# EAGLE design control (EAGLE 9.0.0)
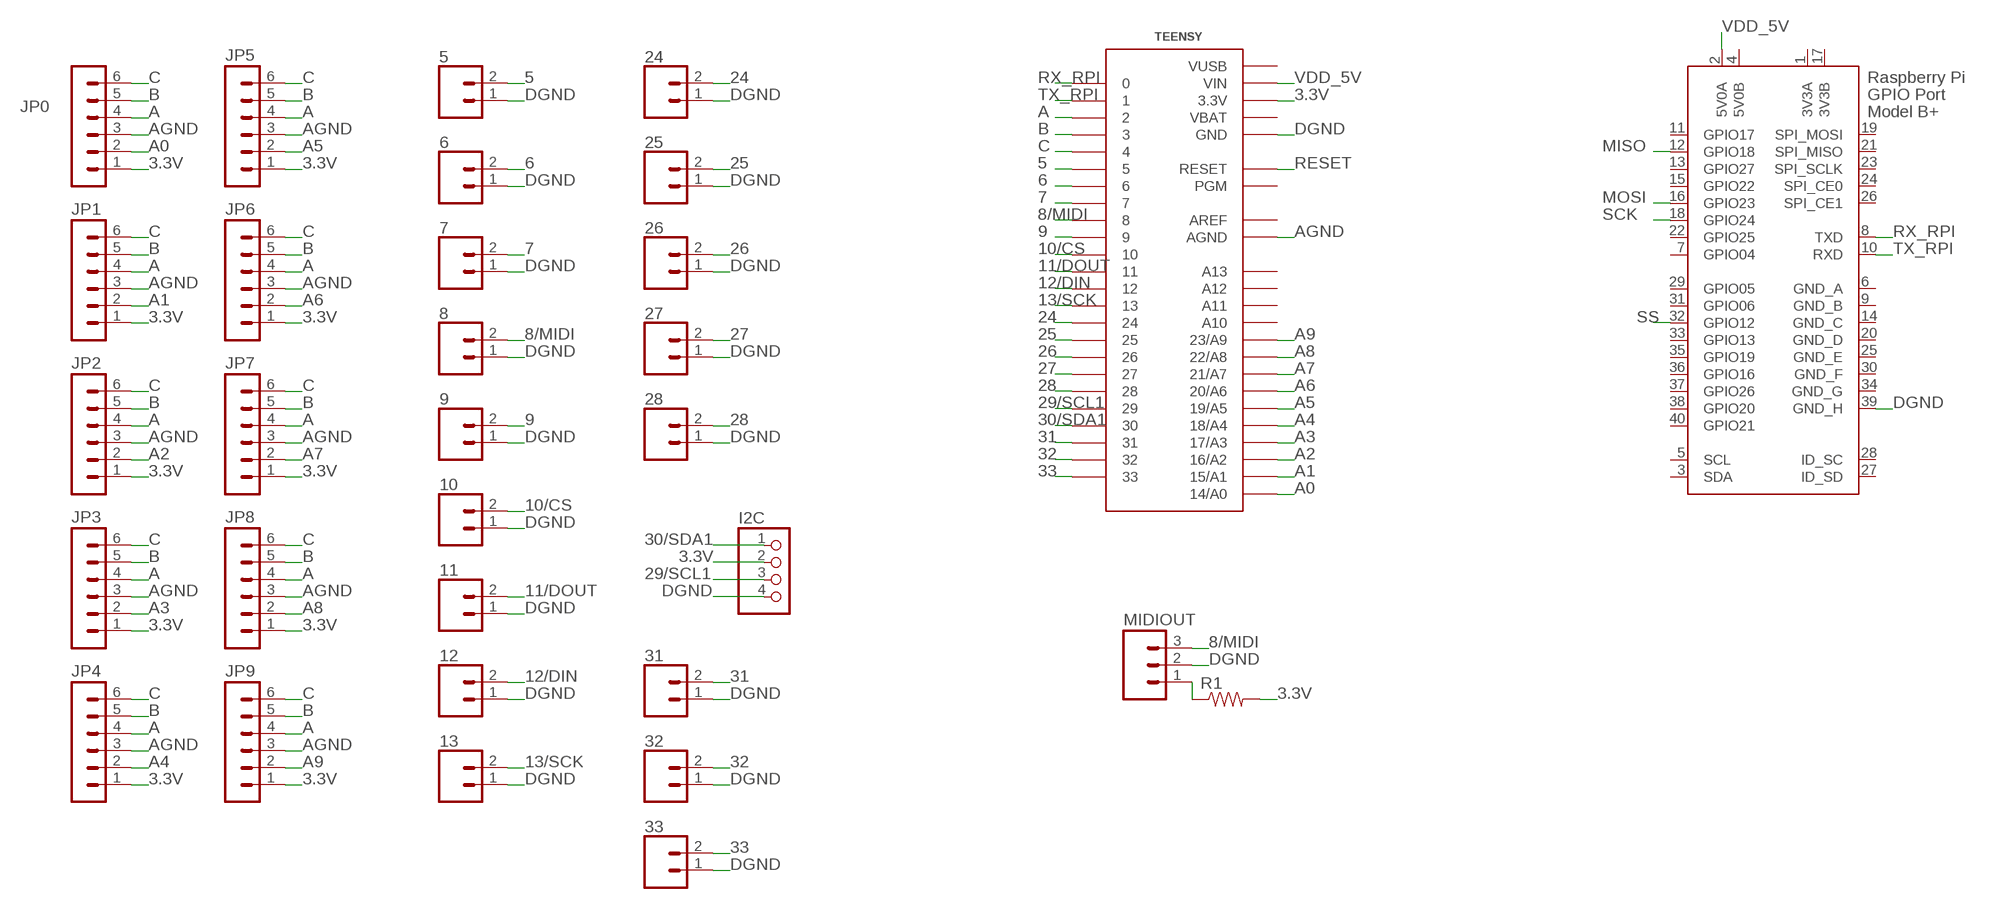
[diagram p0: schematic, sheet 1]

## Parts
5  CONN_02  [1X02]
6  CONN_02  [1X02]
7  CONN_02  [1X02]
8  CONN_02  [1X02]
9  CONN_02  [1X02]
10  CONN_02  [1X02]
11  CONN_02  [1X02]
12  CONN_02  [1X02]
13  CONN_02  [1X02]
24  CONN_02  [1X02]
25  CONN_02  [1X02]
26  CONN_02  [1X02]
27  CONN_02  [1X02]
28  CONN_02  [1X02]
31  CONN_02  [1X02]
32  CONN_02  [1X02]
33  CONN_02  [1X02]
I2C  PINHD-1X4  [1X04]
JP0  MA06-1  [MA06-1]
JP1  MA06-1  [MA06-1]
JP2  MA06-1  [MA06-1]
JP3  MA06-1  [MA06-1]
JP4  MA06-1  [MA06-1]
JP5  MA06-1  [MA06-1]
JP6  MA06-1  [MA06-1]
JP7  MA06-1  [MA06-1]
JP8  MA06-1  [MA06-1]
JP9  MA06-1  [MA06-1]
MIDIOUT  M03PTH  [1X03]
R1  RESISTORAXIAL-0.3  [AXIAL-0.3]
TEENSY  TEENSY_3.0_ALLPINS  [TEENSY_3.0_ALLPINS]
X1  RASPI_BOARD_B+#_H  [RASPI_BOARD_B+HAT]

## Nets
3.3V: I2C.2 JP0.1 JP1.1 JP2.1 JP3.1 JP4.1 JP5.1 JP6.1 JP7.1 JP8.1 JP9.1 R1.P$2 TEENSY.3.3V TEENSY.3.3V1(3.3V) TEENSY.3.3V2(3.3V)
5: 5.2 TEENSY.5
6: 6.2 TEENSY.6
7: 7.2 TEENSY.7
8/MIDI: 8.2 MIDIOUT.3 TEENSY.8
9: 9.2 TEENSY.9
10/CS: 10.2 TEENSY.10
11/DOUT: 11.2 TEENSY.11
12/DIN: 12.2 TEENSY.12
13/SCK: 13.2 TEENSY.13
24: 24.2 TEENSY.24
25: 25.2 TEENSY.25
26: 26.2 TEENSY.26
27: 27.2 TEENSY.27
28: 28.2 TEENSY.28
29/SCL1: I2C.3 TEENSY.29
30/SDA1: I2C.1 TEENSY.30
31: 31.2 TEENSY.31
32: 32.2 TEENSY.32
33: 33.2 TEENSY.33
A: JP0.4 JP1.4 JP2.4 JP3.4 JP4.4 JP5.4 JP6.4 JP7.4 JP8.4 JP9.4 TEENSY.2
A0: JP0.2 TEENSY.14/A0
A1: JP1.2 TEENSY.15/A1
A2: JP2.2 TEENSY.16/A2
A3: JP3.2 TEENSY.17/A3
A4: JP4.2 TEENSY.18/A4
A5: JP5.2 TEENSY.19/A5
A6: JP6.2 TEENSY.20/A6
A7: JP7.2 TEENSY.21/A7
A8: JP8.2 TEENSY.22/A8
A9: JP9.2 TEENSY.23/A9
AGND: JP0.3 JP1.3 JP2.3 JP3.3 JP4.3 JP5.3 JP6.3 JP7.3 JP8.3 JP9.3 TEENSY.AGND
B: JP0.5 JP1.5 JP2.5 JP3.5 JP4.5 JP5.5 JP6.5 JP7.5 JP8.5 JP9.5 TEENSY.3
C: JP0.6 JP1.6 JP2.6 JP3.6 JP4.6 JP5.6 JP6.6 JP7.6 JP8.6 JP9.6 TEENSY.4
DGND: 5.1 6.1 7.1 8.1 9.1 10.1 11.1 12.1 13.1 24.1 25.1 26.1 27.1 28.1 31.1 32.1 33.1 I2C.4 MIDIOUT.2 TEENSY.GND TEENSY.GND1(GND) TEENSY.GND2(GND) X1.39(GND_H)
MISO: X1.12(GPIO18)
MOSI: X1.16(GPIO23)
N$3: MIDIOUT.1 R1.P$1
RESET: TEENSY.RESET
RX_RPI: TEENSY.0 X1.8(TXD)
SCK: X1.18(GPIO24)
SS: X1.32(GPIO12)
TX_RPI: TEENSY.1 X1.10(RXD)
VDD_5V: TEENSY.VIN X1.2(5V0A)
Unconnected: TEENSY.A10 TEENSY.A11 TEENSY.A12 TEENSY.A13 TEENSY.PGM X1.3(SDA) X1.5(SCL) X1.7(GPIO04) X1.11(GPIO17) X1.13(GPIO27) X1.15(GPIO22) X1.19(SPI_MOSI) X1.21(SPI_MISO) X1.22(GPIO25) X1.23(SPI_SCLK) X1.24(SPI_CE0) X1.26(SPI_CE1) X1.27(ID_SD) X1.28(ID_SC) X1.29(GPIO05) X1.31(GPIO06) X1.33(GPIO13) X1.35(GPIO19) X1.36(GPIO16) X1.37(GPIO26) X1.38(GPIO20) X1.40(GPIO21)

## Power pins joined to a net without a drawn wire
3V3A: X1.1(3V3A)
3V3B: X1.17(3V3B)
5V0B: X1.4(5V0B)
AREF: TEENSY.AREF
GND_A: X1.6(GND_A)
GND_B: X1.9(GND_B)
GND_C: X1.14(GND_C)
GND_D: X1.20(GND_D)
GND_E: X1.25(GND_E)
GND_F: X1.30(GND_F)
GND_G: X1.34(GND_G)
VBAT: TEENSY.VBAT
VUSB: TEENSY.VUSB

## Library data of the parts
5-13 24-28 31-33 = SparkFun-Connectors:CONN_02: Multi connection point. Often used as Generic Header-pin footprint for 0.1 inch spaced/style header connections On any of the 0.1 inch spaced packages, you can populate with these: Break Away Headers - Straight <https://www.sparkfun.com/products/116> (PRT-00116) Break Away Male Headers - Right Angle <https://www.sparkfun.com/products/553> (PRT-00553) Female Headers <https://www.sparkfun.com/products/115> (PRT-00115) Break Away Headers - Machine Pin <https://www.sparkfun.com/products/117> (PRT-00117) Break Away Female Headers - Swiss Machine Pin <https://www.sparkfun.com/products/743> (PRT-00743) For SCREWTERMINALS and SPRING TERMINALS visit here: Screw Terimnals on SparkFun.com <https://www.sparkfun.com/search/results?term=Screw+Terminals> (5mm/3.5mm/2.54mm spacing) This device is also useful as a general connection point to wire up your design to another part of your project. Our various solder wires solder well into these plated through hole pads. Hook-Up Wire - Assortment (Stranded, 22 AWG) <https://www.sparkfun.com/products/11375> (PRT-11375) Hook-Up Wire - Assortment (Solid Core, 22 AWG) <https://www.sparkfun.com/products/11367> (PRT-11367) View the entire wire category on our website here <https://www.sparkfun.com/categories/141> Special notes: Molex polarized connector foot print use with: PRT-08233 with associated crimp pins and housings. 2.54_SCREWTERM for use with PRT-10571. 3.5mm Screw Terminal footprints for PRT-08084 5mm Screw Terminal footprints for use with PRT-08432
I2C = pinhead:PINHD-1X4: PIN HEADER
JP0 JP1-JP9 = con-lstb:MA06-1: PIN HEADER; OC_FARNELL: unknown; OC_NEWARK: unknown
MIDIOUT = SparkFun-Connectors:M03: Header 3 Standard 3-pin 0.1" header. Use with straight break away headers (SKU : PRT-00116), right angle break away headers (PRT-00553), swiss pins (PRT-00743), machine pins (PRT-00117), and female headers (PRT-00115). Molex polarized connector foot print use with SKU : PRT-08232 with associated crimp pins and housings.
R1 = SparkFun-Resistors:RESISTOR: Resistor Basic schematic elements and footprints for 0603, 1206, and PTH resistors.
TEENSY = Teensy3.0:TEENSY_3.0_ALLPINS: Teensy 3.0 with all pin holes and optional SMD-mount unshrouded header on bottom of Teensy 3.0. For more basic versions, see 'Basic', '+4' and 'AllAnalogPins'. Requires the installation of a un-shrouded SMD header on the underside of the Teensy 3.0
X1 = raspberrypi_bastelstube_v13:RASPI_BOARD_B+#: Raspberry Pi GPIO connector with markings for the outer dimensions of the Raspberry Pi board model B+ with different sets of drill holes or mounting pads All pins connected

## Board
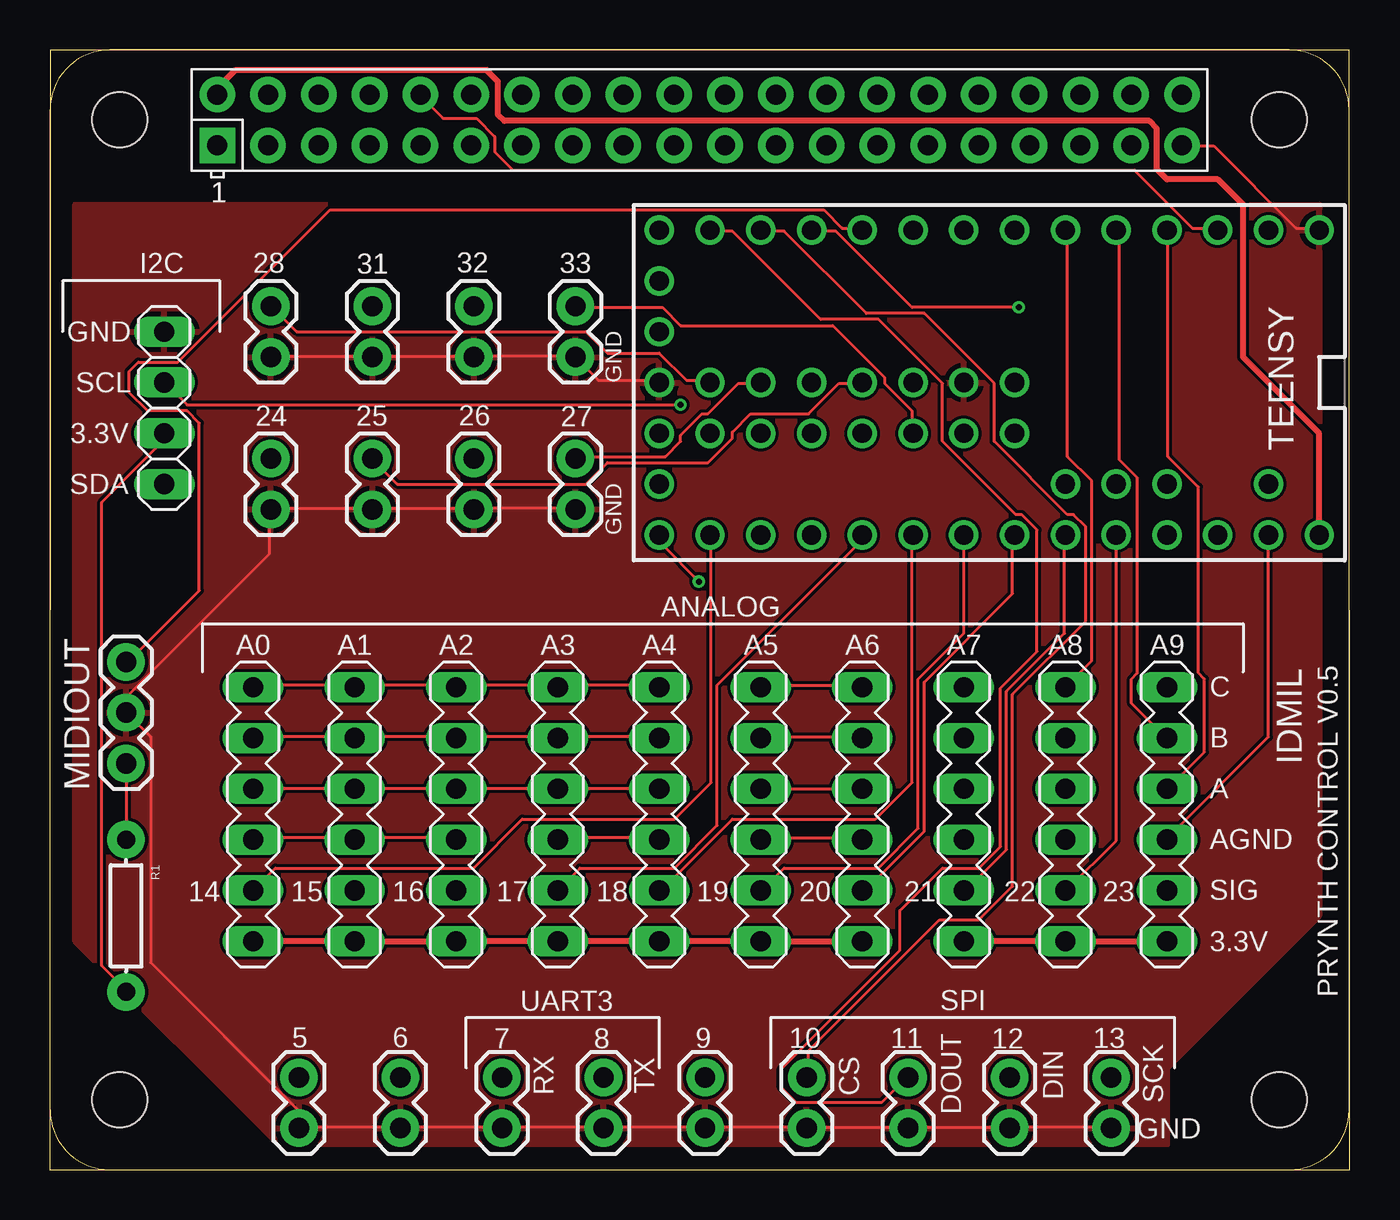
[diagram p1: board, top side]
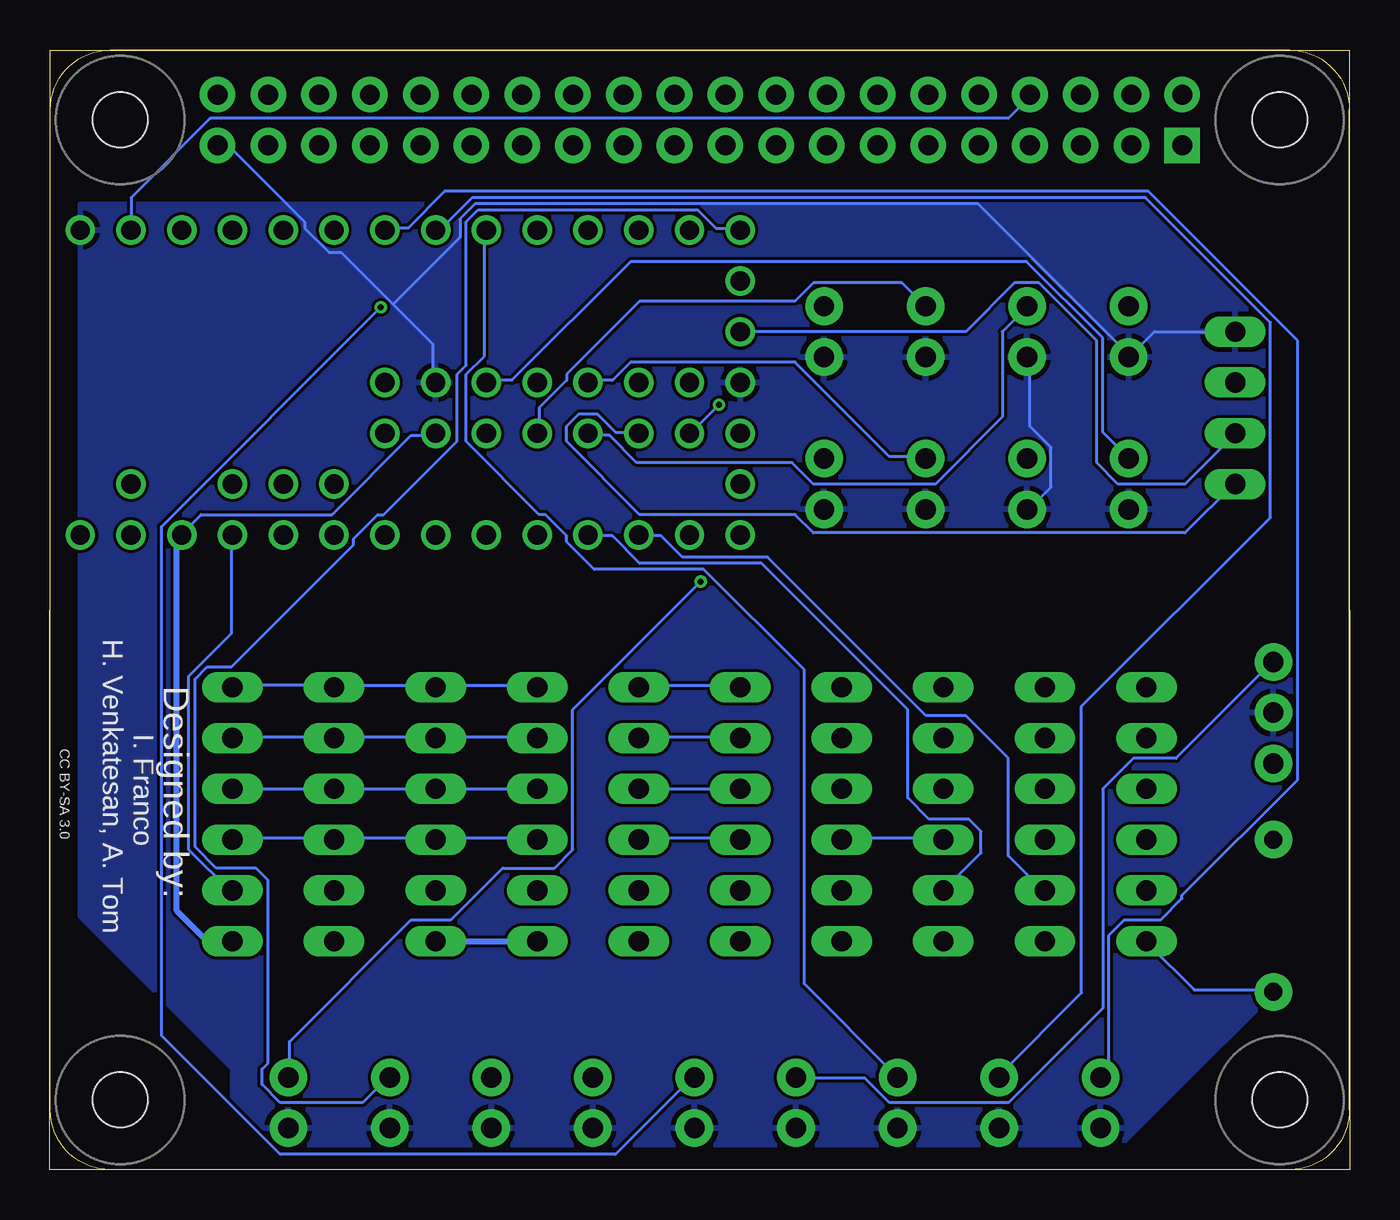
[diagram p2: board, bottom side, seen from below]

Size 65.01 x 56 mm. Coordinates in mm from the lower left corner, seen from the top.
Outline: 0,0 65.02,0 65,56 0,55.98 0,0
Copper layers (1*16): Top 0.035mm / dielectric 1.5mm / Bottom 0.035mm
Design rules "dirt_cheap_dirty_boards.v1.1": minimum track width 6mil, minimum drill 12mil, track to track 6mil, track to pad 6mil, pad to pad 6mil, via to via 6mil, smd to smd 0mil, copper to edge 10mil, drill to drill 10mil, minimum pad ring 10mil, minimum via ring 6mil, stop-mask expansion 2mil, vias tented up to drill 25mil, thermal gap 10mil

### Footprints (pad centres in the part's own frame; a part is rotated, then mirrored left to right if it is on the bottom)
1X02 = drill 1.016 pad 1.88: 1 0,0; 2 2.54,0
1X04 = drill 1.016 long: 1 -3.81,0; 2 -1.27,0; 3 1.27,0; 4 3.81,0
MA06-1 = drill 1.016 long: 1 -6.35,0; 2 -3.81,0; 3 -1.27,0; 4 1.27,0; 5 3.81,0; 6 6.35,0
1X03 = drill 1.016 pad 1.88: 1 0,0; 2 2.54,0; 3 5.08,0
AXIAL-0.3 = drill 0.9 pad 1.88: P$1 -3.81,0; P$2 3.81,0
TEENSY_3.0_ALLPINS = drill 0.965: 0 -7.62,13.97; 1 -7.62,11.43; 2 -7.62,8.89; 3 -7.62,6.35; 3.3V 7.62,11.43; 3.3V1 -2.54,-16.51; 3.3V2 2.54,-1.27; 4 -7.62,3.81; 5 -7.62,1.27; 6 -7.62,-1.27; 7 -7.62,-3.81; 8 -7.62,-6.35; 9 -7.62,-8.89; 10 -7.62,-11.43; 11 -7.62,-13.97; 12 -7.62,-16.51; 13 7.62,-16.51; 14/A0 7.62,-13.97; 15/A1 7.62,-11.43; 16/A2 7.62,-8.89; 17/A3 7.62,-6.35; 18/A4 7.62,-3.81; 19/A5 7.62,-1.27; 20/A6 7.62,1.27; 21/A7 7.62,3.81; 22/A8 7.62,6.35; 23/A9 7.62,8.89; 24 0,-3.81; 25 0,-6.35; 26 0,-8.89; 27 0,-11.43; 28 0,-13.97; 29 2.54,-13.97; 30 2.54,-11.43; 31 2.54,-8.89; 32 2.54,-6.35; 33 2.54,-3.81; A10 5.08,6.35; A11 5.08,3.81; A12 0,1.27; A13 2.54,1.27; AGND 7.62,13.97; AREF 5.08,8.89; GND -7.62,16.51; GND1 0,-16.51; GND2 0,-1.27; PGM 2.54,-16.51; RESET 5.08,-16.51; VBAT -5.08,-16.51; VIN 7.62,16.51; VUSB 5.08,13.97
RASPI_BOARD_B+HAT = drill 1 pad 1.778 square: 1 8.37,51.23 | drill 1 pad 1.778: 2 8.37,53.77; 3 10.91,51.23; 4 10.91,53.77; 5 13.45,51.23; 6 13.45,53.77; 7 15.99,51.23; 8 15.99,53.77; 9 18.53,51.23; 10 18.53,53.77; 11 21.07,51.23; 12 21.07,53.77; 13 23.61,51.23; 14 23.61,53.77; 15 26.15,51.23; 16 26.15,53.77; 17 28.69,51.23; 18 28.69,53.77; 19 31.23,51.23; 20 31.23,53.77; 21 33.77,51.23; 22 33.77,53.77; 23 36.31,51.23; 24 36.31,53.77; 25 38.85,51.23; 26 38.85,53.77; 27 41.39,51.23; 28 41.39,53.77; 29 43.93,51.23; 30 43.93,53.77; 31 46.47,51.23; 32 46.47,53.77; 33 49.01,51.23; 34 49.01,53.77; 35 51.55,51.23; 36 51.55,53.77; 37 54.09,51.23; 38 54.09,53.77; 39 56.63,51.23; 40 56.63,53.77 | hole 2.75: 3.5,3.5; 3.5,52.5; 61.5,3.5; 61.5,52.5

### Placement (x,y rotation side)
5  12.45,2.08 90 top
6  17.53,2.08 90 top
7  22.61,2.08 90 top
8  27.69,2.08 90 top
9  32.77,2.08 90 top
10  37.85,2.08 90 top
11  42.93,2.08 90 top
12  48.01,2.08 90 top
13  53.09,2.08 90 top
24  11.05,33.02 90 top
25  16.13,33.02 90 top
26  21.21,33.02 90 top
27  26.29,33.02 90 top
28  11.05,40.64 90 top
31  16.13,40.64 90 top
32  21.21,40.64 90 top
33  26.29,40.64 90 top
I2C  5.71,38.1 90 top
JP0  10.16,17.78 90 top
JP1  15.24,17.78 90 top
JP2  20.32,17.78 90 top
JP3  25.4,17.78 90 top
JP4  30.48,17.78 90 top
JP5  35.56,17.78 90 top
JP6  40.64,17.78 90 top
JP7  45.72,17.78 90 top
JP8  50.8,17.78 90 top
JP9  55.88,17.78 90 top
MIDIOUT  3.81,20.32 90 top
R1  3.81,12.7 270 top
TEENSY  46.99,39.37 270 top
X1  0,0 0 top

### Tracks (layer width: path | path; a pad name or v marks a point on that pad's centre or on a via)
3.3V
  Top 0.152: 20.42,11.43 JP2.1 20.27,11.43 | 25.3,11.43 JP3.1 25.45,11.43 | 10.21,11.43 JP0.1 | JP1.1 15.39,11.43 | 30.63,11.43 JP4.1 | 35.51,11.43 JP5.1 35.66,11.43 | 40.54,11.43 JP6.1 | 45.87,11.43 JP7.1 | 50.75,11.43 JP8.1 50.9,11.43 | 55.78,11.43 JP9.1 | I2C.2 5.64,36.73 5.64,36.43 2.59,33.38 2.59,10.22 3.81,9 R1.P$2
  Top 0.305: 25.3,11.43 20.42,11.43 | JP1.1 10.21,11.43 | 15.39,11.43 20.27,11.43 | 35.51,11.43 30.63,11.43 | 35.66,11.43 40.54,11.43 | 50.75,11.43 45.87,11.43 | 50.9,11.43 55.78,11.43 | JP4.1 25.45,11.43
  Bottom 0.152: TEENSY.3.3V1 19.2,41.91 16.76,44.35 15.54,44.35 12.65,41.46 12.65,35.36 11.58,34.29 8.23,34.29 5.79,36.73 I2C.2 | R1.P$2 3.96,9 7.77,9 10.06,11.28 JP0.1 | TEENSY.3.3V2 45.87,36.73 46.94,36.73 50.9,32.77 57.45,32.77 58.37,31.86 TEENSY.3.3V 58.37,31.7 | 40.69,11.43 JP6.1 | JP7.1 | 55.93,11.43 JP9.1
  Bottom 0.305: JP7.1 40.69,11.43 | JP9.1 57.15,11.43 58.67,12.96 58.67,31.5 TEENSY.3.3V
5
  Bottom 0.152: TEENSY.5 48.16,47.1 47.09,47.1 45.26,48.92 10.06,48.92 2.59,41.46 2.59,19.51 8.38,13.72 8.38,13.57 9.45,12.5 11.28,12.5 12.04,11.74 12.04,5.03 12.34,4.73 5.2
6
  Bottom 0.152: TEENSY.6 45.72,47.1 45.41,47.1 43.89,48.62 10.21,48.62 3.96,42.37 3.96,32.62 13.41,23.17 13.41,8.84 17.53,4.73 6.2
7
  Bottom 0.152: TEENSY.7 43.28,46.94 43.28,40.7 44.2,39.78 44.2,36.43 40.54,32.77 40.23,32.77 39.17,31.7 39.17,31.4 37.8,30.03 32.31,30.03 27.28,25 27.28,9.3 22.71,4.73 7.2
8/MIDI
  Top 0.152: TEENSY.8 40.54,47.1 39.62,47.1 38.71,48.01 14.02,48.01 6.4,40.39 4.42,40.39 3.96,39.93 3.96,38.87 4.88,37.95 6.86,37.95 7.47,37.34 7.47,28.96 3.96,25.46 MIDIOUT.3
  Bottom 0.152: 8.2 27.58,4.58 24.23,4.58 23.01,3.36 17.07,3.36 12.34,8.08 12.34,19.05 10.82,20.58 8.69,20.58 3.96,25.3 MIDIOUT.3
9  (via drill 0.3)
  Top 0.152: v48.46,43.13 43.13,43.13 39.32,46.94 38.25,46.94 TEENSY.9
  Bottom 0.152: v48.46,43.13 59.44,32.16 59.44,6.71 53.49,0.77 36.73,0.77 32.92,4.58 9.2
10/CS
  Top 0.152: TEENSY.10 35.66,46.94 36.73,46.94 40.84,42.83 43.74,42.83 47.24,39.32 47.24,36.43 50.9,32.77 51.21,32.77 51.82,32.16 51.82,27.44 48.16,23.78 48.16,14.18 46.48,12.5 44.5,12.5 37.95,5.95 37.95,4.73 10.2
11/DOUT
  Top 0.152: TEENSY.11 33.07,46.94 34.14,46.94 38.56,42.52 41.45,42.52 44.65,39.32 44.65,36.43 48.31,32.77 48.62,32.77 49.38,32.01 49.38,25.91 47.55,24.08 47.55,16.16 46.48,15.09 44.65,15.09 42.52,12.96 42.52,10.98 36.58,5.03 36.58,4.12 37.34,3.36 41.6,3.36 42.82,4.58 11.2
12/DIN
  Bottom 0.152: TEENSY.12 30.63,47.1 31.7,47.1 32.61,48.01 43.59,48.01 44.2,47.4 44.2,40.24 44.65,39.78 44.65,36.43 48.31,32.77 48.62,32.77 49.84,31.55 49.84,31.25 55.93,25.15 57.15,25.15 57.76,24.54 57.76,16.16 56.69,15.09 54.71,15.09 54.1,14.48 54.1,5.34 54.41,5.03 54.41,4.27 53.49,3.36 49.38,3.36 48.16,4.58 12.2
13/SCK  (via drill 0.3)
  Top 0.152: v32.46,29.42 30.63,31.25 30.63,31.7 TEENSY.13
  Bottom 0.152: v32.46,29.42 38.86,23.02 38.86,16.01 39.78,15.09 42.37,15.09 44.96,12.5 46.94,12.5 53.03,6.41 53.03,4.73 13.2
24
  Bottom 0.152: TEENSY.24 43.13,39.48 41.91,39.48 35.97,45.42 16.15,45.42 12.34,41.61 12.34,36.89 11.12,35.67 24.2
25
  Top 0.152: TEENSY.25 40.54,39.32 39.47,39.32 37.95,37.8 35.05,37.8 34.14,36.89 34.14,36.58 32.92,35.36 27.89,35.36 26.82,34.29 17.37,34.29 16.15,35.51 25.2
26
  Bottom 0.152: TEENSY.26 38.1,39.48 36.88,39.48 35.97,40.39 27.74,40.39 23.01,35.67 21.34,35.67 26.2
27
  Top 0.152: TEENSY.27 35.51,39.32 34.44,39.32 32.92,37.8 32.61,37.8 31.55,36.73 31.55,36.43 30.79,35.67 26.36,35.67 27.2
28
  Top 0.152: TEENSY.28 32.92,39.48 31.85,39.48 30.48,40.85 27.89,40.85 26.82,41.91 12.34,41.91 11.12,43.13 28.2
29/SCL1  (via drill 0.3)
  Top 0.152: v31.55,38.26 6.86,38.26 5.79,39.32 I2C.3
  Bottom 0.152: v31.55,38.26 32.92,36.89 TEENSY.29
30/SDA1
  Bottom 0.152: TEENSY.30 35.66,36.89 36.73,36.89 37.64,37.8 38.56,37.8 39.17,37.19 39.17,36.43 35.51,32.77 27.74,32.77 26.82,31.86 8.23,31.86 5.79,34.29 I2C.1
31
  Bottom 0.152: TEENSY.31 38.1,36.73 37.03,36.73 35.66,35.36 27.89,35.36 26.82,34.29 20.73,34.29 17.37,37.65 17.37,41.91 16.15,43.13 31.2
32
  Bottom 0.152: TEENSY.32 40.54,36.89 40.54,38.1 39.17,39.48 39.17,39.78 35.51,43.44 27.74,43.44 26.82,44.35 22.4,44.35 21.34,43.29 32.2
33
  Top 0.152: TEENSY.33 43.13,36.89 43.13,37.95 41.76,39.32 41.76,39.63 39.17,42.22 31.55,42.22 30.63,43.13 26.36,43.13 33.2
A
  Top 0.152: JP0.4 10.21,19.05 JP1.4 15.39,19.05 20.27,19.05 JP2.4 20.42,19.05 25.3,19.05 JP3.4 25.45,19.05 JP4.4 | JP6.4 40.54,19.05 35.66,19.05 JP5.4 | TEENSY.2 55.93,46.94 55.93,35.67 57.45,34.14 57.45,24.85 57.76,24.54 57.76,20.88 55.93,19.05 JP9.4
  Bottom 0.152: JP4.4 30.63,19.05 35.51,19.05 JP5.4 | JP9.4 55.78,19.05 50.9,19.05 JP8.4 50.75,19.05 45.87,19.05 JP7.4 40.69,19.05 JP6.4
A0
  Top 0.152: TEENSY.14/A0 33.07,31.7 33.07,19.36 31.24,17.53 23.62,17.53 21.18,15.09 11.28,15.09 10.21,14.03 JP0.2
A1
  Bottom 0.152: TEENSY.15/A1 35.51,31.7 34.44,31.7 33.38,30.64 29.11,30.64 21.18,22.71 19.2,22.71 17.07,20.58 17.07,15.7 15.39,14.03 JP1.2
A2
  Bottom 0.152: TEENSY.16/A2 38.1,31.7 36.88,31.7 35.51,30.33 29.41,30.33 22.1,23.02 22.1,18.6 21.03,17.53 19.05,17.53 18.44,16.92 18.44,15.85 20.27,14.03 JP2.2
A3
  Top 0.152: TEENSY.17/A3 40.54,31.7 40.54,31.4 33.38,24.24 33.38,17.23 31.24,15.09 26.52,15.09 25.45,14.03 JP3.2
A4
  Top 0.152: TEENSY.18/A4 43.13,31.7 43.13,19.36 41.3,17.53 34.14,17.53 30.63,14.03 JP4.2
A5
  Top 0.152: TEENSY.19/A5 45.72,31.7 45.72,26.83 43.43,24.54 43.43,17.07 41.45,15.09 36.73,15.09 35.66,14.03 JP5.2
A6
  Top 0.152: TEENSY.20/A6 48.16,31.7 48.16,28.81 43.74,24.39 43.74,16.92 40.69,13.87 JP6.2
A7
  Top 0.152: TEENSY.21/A7 50.75,31.7 50.75,26.83 47.85,23.93 47.85,16.01 45.87,14.03 JP7.2
A8
  Top 0.152: TEENSY.22/A8 53.34,31.7 53.34,16.46 50.9,14.03 JP8.2
A9
  Bottom 0.152: TEENSY.23/A9 55.93,31.7 55.93,26.83 58.06,24.69 58.06,16.01 55.93,13.87 JP9.2
AGND
  Top 0.152: JP0.3 10.21,16.62 15.24,16.62 JP1.3 15.39,16.62 20.27,16.62 JP2.3 | JP6.3 40.54,16.62 35.66,16.62 JP5.3 | TEENSY.AGND 60.96,31.7 60.96,21.65 55.93,16.62 JP9.3 | JP3.3 25.45,16.62 30.48,16.62 JP4.3
  Bottom 0.152: JP2.3 20.42,16.62 25.3,16.62 JP3.3 | JP4.3 30.63,16.62 35.51,16.62 JP5.3 | JP9.3 55.78,16.62 50.9,16.62 JP8.3 50.75,16.62 45.87,16.62 JP7.3 45.72,16.62 40.69,16.62 JP6.3
B
  Top 0.152: JP0.5 10.21,21.65 15.24,21.65 JP1.5 15.39,21.65 20.27,21.65 JP2.5 20.42,21.65 25.3,21.65 JP3.5 25.45,21.65 30.48,21.65 JP4.5 | JP6.5 40.54,21.65 35.66,21.65 JP5.5 | TEENSY.3 53.49,46.94 53.49,35.51 54.41,34.6 54.41,24.85 54.1,24.54 54.1,23.32 55.78,21.65 JP9.5
  Bottom 0.152: JP4.5 30.63,21.65 35.51,21.65 JP5.5 | JP9.5 55.78,21.65 50.9,21.65 JP8.5 50.75,21.65 45.87,21.65 JP7.5 45.72,21.65 40.69,21.65 JP6.5
C
  Top 0.152: JP0.6 10.21,24.24 15.24,24.24 JP1.6 15.39,24.24 20.27,24.24 JP2.6 20.42,24.24 25.3,24.24 JP3.6 25.45,24.24 30.48,24.24 JP4.6 | JP6.6 40.54,24.24 35.66,24.24 JP5.6 | TEENSY.4 50.9,46.94 50.9,35.67 52.12,34.45 52.12,25.46 50.9,24.24 JP8.6
  Bottom 0.152: JP4.6 30.63,24.24 35.51,24.24 JP5.6 | JP9.6 55.78,24.24 50.9,24.24 JP8.6 50.75,24.24 45.87,24.24 JP7.6 45.72,24.24 40.69,24.24 JP6.6
DGND
  Top 0.152: 13.1 53.03,2.14 48.16,2.14 12.1 48.01,2.14 42.98,2.14 11.1 42.82,2.14 37.95,2.14 10.1 37.8,2.14 32.92,2.14 9.1 32.77,2.14 27.74,2.14 8.1 27.58,2.14 22.71,2.14 7.1 22.55,2.14 17.68,2.14 6.1 17.53,2.14 12.5,2.14 5.1 12.34,2.14 12.34,3.05 5.03,10.37 5.03,21.65 3.96,22.71 MIDIOUT.2 3.96,22.86 3.96,23.78 10.97,30.79 10.97,32.92 24.1 11.12,33.08 16,33.08 25.1 16.15,33.08 21.18,33.08 26.1 21.34,33.08 26.21,33.08 27.1 | TEENSY.GND 63.4,47.1 62.33,47.1 58.22,51.21 56.69,51.21 X1.39 | TEENSY.GND1 30.48,39.48 27.43,39.48 26.36,40.54 33.1 26.21,40.7 21.34,40.7 32.1 21.18,40.7 16.15,40.7 31.1 16,40.7 11.12,40.7 28.1
  Bottom 0.152: 47.85,43.29 50.44,45.88 51.05,45.88 52.27,47.1 52.27,47.4 56.08,51.21 56.54,51.21 X1.39 | 47.85,43.29 45.87,41.3 45.87,39.48 TEENSY.GND2 | I2C.4 9.75,41.91 10.97,40.7 | 31.1 16,40.54 16,37.19 14.94,36.12 14.94,34.14 16,33.08 25.1 | 47.85,43.29 44.5,46.64 44.5,47.55 43.74,48.32 18.59,48.32 10.97,40.7 | 10.97,40.7 28.1
  pour Bottom: 1.27,48.26 63.5,48.26 63.5,12.7 55.88,5.08 55.88,1.27 11.43,1.27 1.27,11.43
  pour Top: 1.27,48.26 63.5,48.26 63.5,12.7 55.88,5.08 55.88,1.27 11.43,1.27 1.27,11.43
N$3
  Top 0.152: R1.P$1 3.81,16.62 3.81,20.27 MIDIOUT.1
RX_RPI
  Bottom 0.152: TEENSY.0 60.96,47.1 60.96,48.62 57,52.58 17.07,52.58 16,53.65 X1.8
TX_RPI
  Top 0.152: TEENSY.1 58.37,47.1 57.15,47.1 54.25,49.99 23.16,49.99 22.25,50.91 22.25,51.67 21.34,52.58 19.66,52.58 18.59,53.65 X1.10
VDD_5V
  Top 0.152: 63.4,31.86 TEENSY.VIN
  Top 0.305: TEENSY.VIN 63.5,36.83 59.69,40.64 59.69,48.26 58.42,49.53 55.88,49.53 55.37,50.04 55.37,52.07 54.99,52.46 22.73,52.46 22.42,52.77 22.42,54.42 21.84,55 9.27,55 8.37,54.1 X1.2

### Text on the board
tNames: I2C | GND | SCL | GND | 3.3V | SDA | GND | ANALOG | A0 | A1 | A2 | A3 | A4 | A5 | A6 | A7 | A8 | A9 | PRYNTH CONTROL V0.5 | C | B | IDMIL | A | AGND | SIG | 14 | 15 | 16 | 17 | 18 | 19 | 20 | 21 | 22 | 23 | 3.3V | UART3 | SPI | RX | TX | CS | DIN | DOUT | SCK | GND
bNames: H. Venkatesan, A. Tom | Designed by: | I. Franco | CC BY-SA 3.0